# Altium project DCBus_PCB.PrjPcb
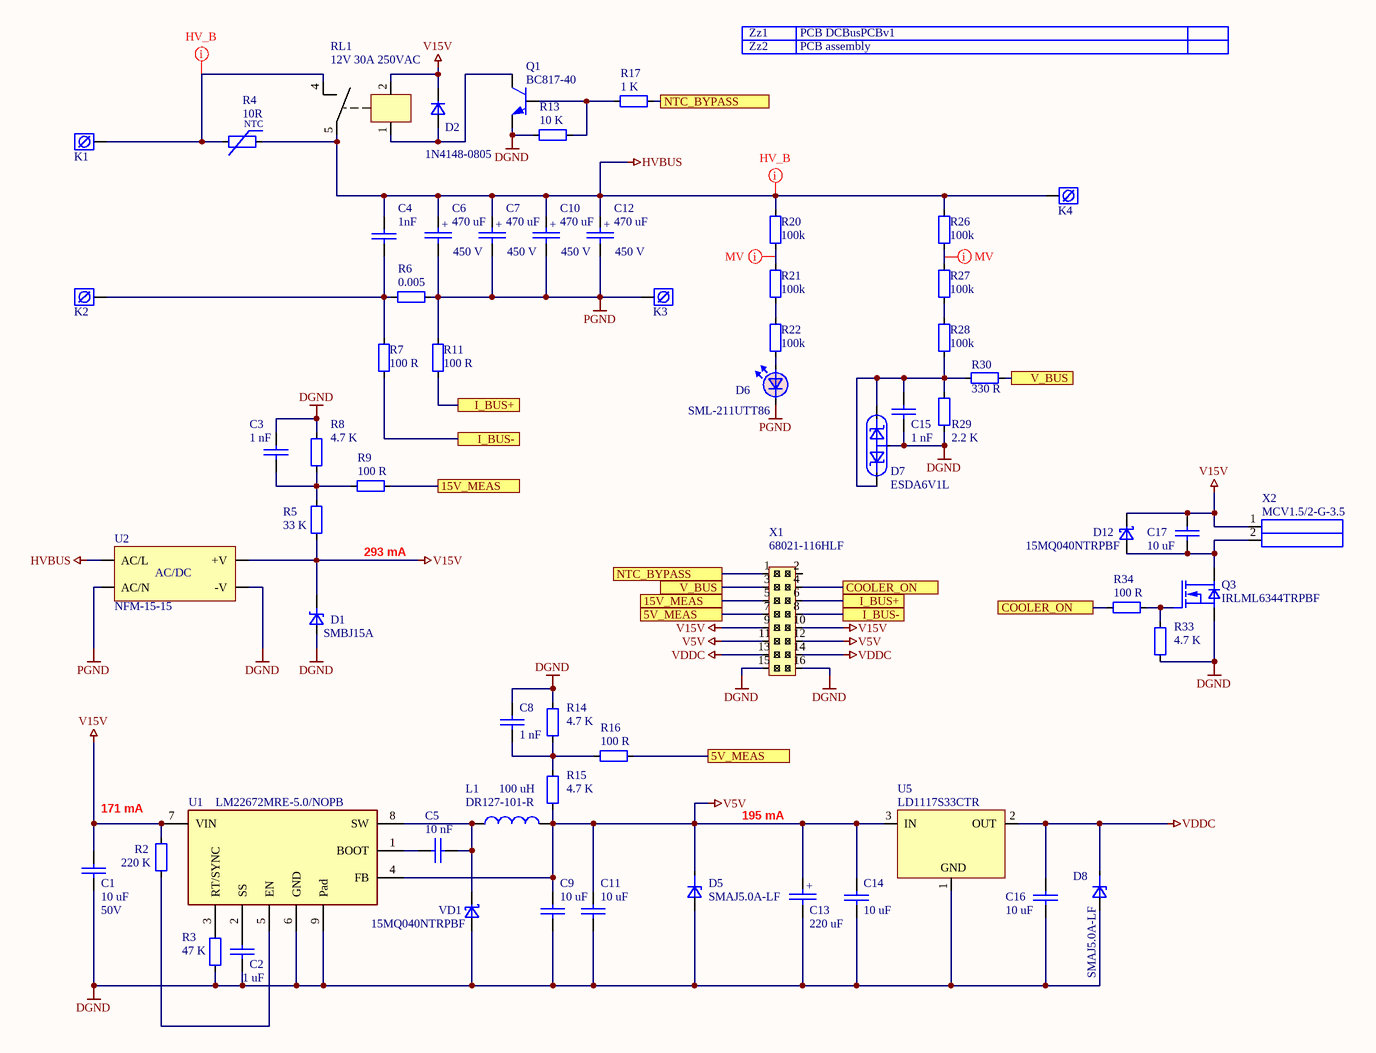
[diagram p0: Page1.SchDoc]
ProductNumber: Inverter; ProjectAuthor: BARDUVA UAB; ProjectVersion: 2013.06.11; Sheets: 2
1 sheet, 64 parts. Net scope: flat (ports and power ports of the same name join across sheets).
Board file: DCBus_PCB_v1.0.PcbDoc

## Sheet Page1.SchDoc
size A3; SheetNumber: 1; PageSetup: Record=PageOptions|CenterHorizontal=True|CenterVertical=True|PrintScale=1.00|XCorrection=1.00|YCorrection=1.00|PrintKind=1|BorderSize=5000000|LeftOffset=0|BottomOffset=0|Orientation=2|PaperLength=4200|PaperWidth=2970|Scale=100|PaperSource=256|PrintQuality=600|MediaType=0|DitherType=0|PaperKind=A3|PrintScaleMode=1

### Parts
C1  value 10 uF  Voltage: 50V  [3225[1210]]  (hidden comment: GRM32DF51H106ZA01L)
C2  value 1 uF  [2012[0805]]  (hidden comment: GRM21BR71A105KA01L)
C3  value 1 nF  [1608[0603]]  (hidden comment: CL10B102KB8NNNC)
C4  value 1nF  [B32529C8102J]  (hidden comment: B32529C8102J)
C5  value 10 nF  [1608[0603]]  (hidden comment: CL10B103JB8NNNC)
C6  value 470 uF  Voltage: 450 V  [ESMH451VNN471MA50T]  (hidden comment: ESMH451VNN471MA50T)
C7  value 470 uF  Voltage: 450 V  [ESMH451VNN471MA50T]  (hidden comment: ESMH451VNN471MA50T)
C8  value 1 nF  [1608[0603]]  (hidden comment: CL10B102KB8NNNC)
C9  value 10 uF  [0805-1206]  (hidden comment: LMK212F106ZG-T)
C10  value 470 uF  Voltage: 450 V  [ESMH451VNN471MA50T]  (hidden comment: ESMH451VNN471MA50T)
C11  value 10 uF  [0805-1206]  (hidden comment: LMK212F106ZG-T)
C12  value 470 uF  Voltage: 450 V  [ESMH451VNN471MA50T]  (hidden comment: ESMH451VNN471MA50T)
C13  value 220 uF  [Tant case C (6032-28)]  (hidden comment: TPSD227M010R0150)
C14  value 10 uF  [0805-1206]  (hidden comment: LMK212F106ZG-T)
C15  value 1 nF  [1608[0603]]  (hidden comment: CL10B102KB8NNNC)
C16  value 10 uF  [0805-1206]  (hidden comment: LMK212F106ZG-T)
C17  value 10 uF  [0805-1206]  (hidden comment: LMK212F106ZG-T)
D1  SMBJ15A  [SMB ST]
D2  1N4148-0805  [DIODE1206_LL4148]
D5  SMAJ5.0A-LF  [DO-214AA_SMBJ]
D6  SML-211UTT86  [0805 LED]
D7  ESDA6V1L  [SOT23]
D8  SMAJ5.0A-LF  [DO-214AA_SMBJ]
D12  15MQ040NTRPBF  [SMA]
K1  Screw terminal KEYS7692 front  [KEY7692_front]  (value not drawn)  (net tie, no BOM)
K2  Screw terminal KEYS7692 front  [KEY7692_front]  (value not drawn)  (net tie, no BOM)
K3  Screw terminal KEYS7692 front  [KEY7692_front]  (value not drawn)  (net tie, no BOM)
K4  Screw terminal KEYS7692 front  [KEY7692_front]  (value not drawn)  (net tie, no BOM)
L1  DR127-101-R  value 100 uH  [DR127]
Q1  BC817-40  [SOT23]
Q3  IRLML6344TRPBF  [SOT23]
R2  value 220 K  [0603]  (hidden comment: RC0603FR-07220KL)
R3  value 47 K  [0603]  (hidden comment: RC0603FR-0747KL)
R4  value 10R  [B57464]  (hidden comment: B57464S100M000)
R5  value 33 K  [0603]  (hidden comment: RC0603FR-0733KL)
R6  value 0.005  [MCS3264]  (hidden comment: MCS3264R005FER)
R7  value 100 R  [0603]  (hidden comment: ERJ-3EKF1000V)
R8  value 4.7 K  [0603]  (hidden comment: RJ0603FRE074K7L)
R9  value 100 R  [0603]  (hidden comment: ERJ-3EKF1000V)
R11  value 100 R  [0603]  (hidden comment: ERJ-3EKF1000V)
R13  value 10 K  [0603]  (hidden comment: ERJ-3EKF1002V)
R14  value 4.7 K  [0603]  (hidden comment: RJ0603FRE074K7L)
R15  value 4.7 K  [0603]  (hidden comment: RJ0603FRE074K7L)
R16  value 100 R  [0603]  (hidden comment: ERJ-3EKF1000V)
R17  value 1 K  [0603]  (hidden comment: RC0603FR-071KL)
R20  value 100k  [3216[1206]]  (hidden comment: ERJ-8ENF1003V)
R21  value 100k  [3216[1206]]  (hidden comment: ERJ-8ENF1003V)
R22  value 100k  [3216[1206]]  (hidden comment: ERJ-8ENF1003V)
R26  value 100k  [3216[1206]]  (hidden comment: ERJ-8ENF1003V)
R27  value 100k  [3216[1206]]  (hidden comment: ERJ-8ENF1003V)
R28  value 100k  [3216[1206]]  (hidden comment: ERJ-8ENF1003V)
R29  value 2.2 K  [0603]  (hidden comment: RC0603FR-072K2L)
R30  value 330 R  [0603]  (hidden comment: RC0603FR-07330RL)
R33  value 4.7 K  [0603]  (hidden comment: RJ0603FRE074K7L)
R34  value 100 R  [0603]  (hidden comment: ERJ-3EKF1000V)
RL1  value 12V 30A 250VAC  [T90]  (hidden comment: T9AS1D12-12)
U1  PartName: LM22672MRE-5.0/NOPB  [SOIC-8 EDP]  (hidden comment: LM22672)
U2  NFM-15-15  [NFM-15]
U5  LD1117S33CTR  [SOT-223]
VD1  15MQ040NTRPBF  [SMA]
X1  68021-116HLF  [68021-116HLF]
X2  MCV1.5/2-G-3.5  [mcv1.5-2-g_3.5]
Zz1  PCB DCBusPCBv1
Zz2  PCB assembly

### Ports
5V_MEAS, 15V_MEAS, COOLER_ON, I_BUS+, I_BUS-, NTC_BYPASS, V_BUS

### Nets
DGND: C1.2 C2.1 C3.1 C8.1 C9.1 C11.1 C13.2 C14.1 C15.2 C16.1 D1.1 D5.2(A) D7.3 D8.2(A) Q1.2(E) Q3.2(S) R3.1 R8.2 R13.1 R14.2 R29.2 R33.1 U1.6(GND) U1.9(Pad) U2.-V U5.1(GND) VD1.A X1.15 X1.16
HVBUS: C4.1 C6.1 C7.1 C10.1 C12.1 K4.1 R4.2 R20.1 R26.1 RL1.5 U2.AC/L
PGND: C6.2 C7.2 C10.2 C12.2 D6.2 K3.1 R6.2 R11.2 U2.AC/N
V5V: C9.2 C11.2 C13.1 C14.2 D5.1(C) L1.2 R15.1 U1.4(FB) U5.3(IN) X1.11 X1.12
V15V: C1.1 C17.2 D1.2 D2.1(C) D12.K R2.2 R5.1 RL1.2 U1.7(VIN) U2.+V X1.9 X1.10 X2.1
VDDC: C16.2 D8.1(C) U5.2(OUT) X1.13 X1.14
5V_MEAS: R16.2 X1.7 ; port 5V_MEAS
15V_MEAS: R9.2 X1.5 ; port 15V_MEAS
COOLER_ON: R34.2 X1.4 ; port COOLER_ON
I_BUS+: R11.1 X1.6 ; port I_BUS+
I_BUS-: R7.1 X1.8 ; port I_BUS-
NTC_BYPASS: R17.1 X1.1 ; port NTC_BYPASS
V_BUS: R30.1 X1.3 ; port V_BUS
NetC2_2: C2.2 U1.2(SS)
NetC3_2: C3.2 R5.2 R8.1 R9.1
NetC4_2: C4.2 K2.1 R6.1 R7.2
NetC5_1: C5.1 L1.1 U1.8(SW) VD1.K
NetC5_2: C5.2 U1.1(BOOT)
NetC8_2: C8.2 R14.1 R15.2 R16.1
NetC15_1: C15.1 D7.1 D7.2 R28.2 R29.1 R30.2
NetC17_1: C17.1 D12.A Q3.3(D) X2.2
NetD2_2: D2.2(A) Q1.3(C) RL1.1
NetD6_1: D6.1 R22.2
NetK1_1: K1.1 R4.1 RL1.4
NetQ1_1: Q1.1(B) R13.2 R17.2
NetQ3_1: Q3.1(G) R33.2 R34.1
NetR2_1: R2.1 U1.5(EN)
NetR3_2: R3.2 U1.3(RT/SYNC)
NetR20_2: R20.2 R21.1
NetR21_2: R21.2 R22.1
NetR26_2: R26.2 R27.1
NetR27_2: R27.2 R28.1

Not connected (* = marked no-connect by the designer): X1 2

### Layout directives
net class HV_B: HVBUS, NetK1_1
net class MV: NetR20_2, NetR26_2

### Notes on the sheet
- 293 mA
- 171 mA
- 195 mA
- (in symbol B57464S100M000) NTC
- (in symbol ESMH451VNN471MA50T) +
- (in symbol NFM-15-15) AC/DC
- (in symbol T520C157M010ATE055) +

### Library data of the parts
C1 = GRM32DF51H106ZA01L: 10uF, 50V, 20%, Y5V (F), 1210; Manufacturer: Murata Electronics North America; PartNum: 490-1891-1-ND; Tolerance: 20%; Price: 0.39$; Distributor: Digi-Key; PartName: GRM32DF51H106ZA01L
C2 = GRM21BR71A105KA01L: 1 uF, 10V, 10%, X7R, 0805; Manufacturer: Murata; Tolerance: 10%; Price: 0.11$; Distributor: Mouser; PartNum: GRM21BR71A105KA01L; PartName: GRM21BR71A105KA01L
C3 C8 C15 = CVNF1.0K0603_1: 1 nF, 50V, 10%, X7R, 0603 SMD MLC Capacitor; Manufacturer: SAMSUNG; Tolerance: 10%; Distributor: Future; Price: 0.002$; PartNum: CL10B102KB8NNNC; Voltage: 50 V; PartName: CL10B102KB8NNNC; Price50: 0.002$; Price100: 0.002$; Price1000: 0.002$
C4 = B32529C8102J: CAP FILM 1000PF 630VDC 400VAC RADIAL Lead Spacing 5mm; Manufacturer: Epcos; PartNum: 495-1255-ND; Tolerance: 20%; Voltage: 400VAC 630VDC; Distributor: Digi-Key; Price: 0.45$; PartName: B32529C8102J; Link: http://www.digikey.com/product-detail/en/B32529C8102J/495-1255-ND/592832
C5 = CVNF010K0603: 10 nF, 50V, 5%, X7R, 0603 SMD MLC Capacitor; Manufacturer: SAMSUNG; Tolerance: 5%; Distributor: Future; Price: 0.0045 Euro; PartNum: CL10B103JB8NNNC; Voltage: 50 V; PartName: CL10B103JB8NNNC; Price50: 0.0045 Euro; Price100: 0.0045 Euro; Price1000: 0.0045 Euro
C6 C7 C10 C12 = ESMH451VNN471MA50T: 470uF 450V, 20%, -40..+85, 2000 Hrs @ 85°C, 35*50; Manufacturer: UNITED CHEMICON; Tolerance: +-20%; Distributor: Future; Price: 3 Euro; PartNum: ESMH451VNN471MA50T; PartName: ESMH451VNN471MA50T
C9 C11 C14 C16 C17 = LMK212F106ZG-T: CAP CER 10UF 10V 10% X5R 0805; Manufacturer: Taiyo Yuden; PartNum: 587-1300-1-ND; PartName: LMK212BJ106KG-T; Distributor: Digi-Key; Price: 0.038$; Tolerance: 10%; Voltage: 10V
C13 = T520C157M010ATE055: 220.0 uF, 10V 20%, -55...105 C, SMD Tantalum; Manufacturer: AVX Connectors; Ordered: Future; Distributor: Future; Tolerance: 20%; Price: 0.49 Euro; PartNum: TPSD227M010R0150; Voltage: 10V; PartName: TPSD227M010R0150; Price50: 0.44 Euro; Price100: 0.44 Euro; Price1000: 0.44 Euro
D1 = SMBJ15A: DIODE TVS 15V 600W UNI 5% SMD; Manufacturer: TAIWAN SEMICONDUCTOR; PartNum: 7277733RL; Distributor: Farnell; Price: 1.77; PartName: SMBJ15A; Value: 15 V
D2 = Diode 100V 0805 1N4148: Switching diode; 500mA; 4ns; 0805, 100V, 300mA; Manufacturer: DC COMPONENTS; Distributor: TME; PartNum: 1N4148-0805; Price: 0.054; Link: http://www.tme.eu/lt/details/1n4148-0805/smd-universalus-diodai/dc-components/cd4148ws0805c/#; PartName: 1N4148-0805
D5 D8 = SMAJ5.0A-LF: TVS 400W 5.0V Unidirect; Manufacturer: LITTELFUSE; Distributor: TME; Price: 0.212; PartNum: SMAJ5.0A-LF; PartName: SMAJ5.0A-LF
D6 = SML-211UTT86: 0805 red LED, hibright, 2 mA, 1.8V, 130°; Manufacturer: Rohm; PartNum: 511-1292-1-ND; Distributor: Digi-Key; Price: 0.34$; Value: Red; PartName: SML-211UTT86
D7 = ESDA6V1L: Dual transil array for ESD, 6.1 V, 300 W; Manufacturer: Micro Commercial Co; PartNum: ESDA6V1L-TPCT-ND; PartName: ESDA6V1L-TP; Distributor: Digi-Key; Price: 0.23$
D12 VD1 = 15MQ040N: Schottky Power Rectifier 3A, 40V, SMA; Manufacturer: VISHAY; Ordered: Future; Price: 0.13 Euro; Distributor: Digi-Key; PartNum: 15MQ040NTRPBF; PartName: 15MQ040NTRPBF; Price50: 0.11 Euro; Price100: 0.11 Euro; Price1000: 0.1 Euro
L1 = DR127-101-R: 100 uH, 1.96A, ±20%, 163 mOhm; Manufacturer: Coiltronics/Div of Cooper/Bussmann; PartNum: 513-1038-1-ND; Distributor: Digi-Key; Price: 1.7$; Tolerance: ±20%; PartName: DR127-101-R
Q1 = BC817-40: NPN 45V 0,5A 0,25W B:250-600 SOT23; Manufacturer: NXP Semiconductors; PartNum: 568-1631-1-ND; Price: 0.05$; Distributor: Digi-Key; PartName: 568-1631-1-ND
Q3 = IRLML6344TRPBF: N-channel MOSFET, 30V, 5A, 0.030 Ohm 3.3 V, SOT-23; Manufacturer: International Rectifier; PartNum: IRLML6344TRPBFCT-ND; Price: 0.23$; Distributor: DigiKey; PartName: IRLML6344TRPBF
R2 = RL0603K220-1_1: 220 K, 1%, 0603, SMD Resistor, Taped; Manufacturer: YAGEO AMERICA CORPORATION; Voltage: 75 V; Distributor: Future; Price: 0.0017$; Tolerance: 1%; PartNum: RC0603FR-07220KL; PartName: RC0603FR-07220KL; Price50: 0.0017$; Price100: 0.0017$; Price1000: 0.0017$
R3 = RC0603FR-0747KL: 47 K, 1%, 0603, SMD Resistor, Taped; Manufacturer: YAGEO AMERICA CORPORATION; Voltage: 75 V; Distributor: Future; Price: 0.002 Euro; Tolerance: 1%; PartNum: RC0603FR-0747KL; PartName: RC0603FR-0747KL
R4 = B57464S100M000: CURRENT LIMITER INRSH 10 OHM 20%, 8A, Lead Spacing 7.5mm; Manufacturer: EPCOS Inc; PartNum: 495-4111-ND; Distributor: Digi-Key; Price: 4.78$; Link: http://www.digikey.com/scripts/dksearch/dksus.dll?vendor=0&keywords=B57464S0100M; PartName: B57464S100M000
R5 = RL0603K033-1_1: 33 K, 1%, 0603, SMD Resistor, Taped; Manufacturer: YAGEO AMERICA CORPORATION; Voltage: 75 V; Distributor: Future; Price: 0.0017$; Tolerance: 1%; PartNum: RC0603FR-0733KL; PartName: RC0603FR-0733KL; Price50: 0.0017$; Price100: 0.0017$; Price1000: 0.0017$
R6 = MCS3264R005FER: Curr.sens.res. 0.005 OHM 2W 1% , 2512 (6432 Metric); Manufacturer: Ohmite; PartNum: MCS3264R005FERCT-ND; Distributor: Digi-Key; Price: 0.3$; Tolerance: 1%; PartName: MCS3264R005FER; Price50: 0.3$
R7 R9 R11 R16 R34 = RL0603E100-1_1: 100 R, 1%, 0603, SMD Resistor, Taped; Manufacturer: PANASONIC; Voltage: 75 V; Distributor: Future; Price: 0.0017$; Tolerance: 1%; PartNum: ERJ-3EKF1000V; PartName: ERJ-3EKF1000V; Price50: 0.0015 Euro; Price100: 0.0015 Euro; Price1000: 0.0015 Euro
R8 R14 R15 R33 = RL0603K004.7-1_1: 4.7 K, 1%, 0603, SMD Resistor, Taped; Manufacturer: YAGEO AMERICA CORPORATION; Voltage: 75 V; Distributor: Future; Price: 0.0017$; Tolerance: 1%; PartNum: RJ0603FRE074K7L; PartName: RJ0603FRE074K7L; Price50: 0.0017$; Price100: 0.0017$; Price1000: 0.0017$
R13 = RL0603K010-1: 10 K, 1%, 0603, SMD Resistor, Taped; Manufacturer: PANASONIC; Voltage: 75 V; Distributor: Future; Price: 0.0015 Euro; Tolerance: 1%; PartNum: ERJ-3EKF1002V; PartName: ERJ-3EKF1002V; Price50: 0.0015 Euro; Price100: 0.0015 Euro; Price1000: 0.0015 Euro
R17 = RL0603K001-1_1: 1 K, 1%, 0603, SMD Resistor, Taped; Manufacturer: YAGEO AMERICA CORPORATION; Voltage: 75 V; Distributor: Future; Price: 0.0017$; Tolerance: 1%; PartNum: RC0603FR-071KL; PartName: RC0603FR-071KL; Price50: 0.0017$; Price100: 0.0017$; Price1000: 0.0017$
R20-R22 R26-R28 = RL1206K100-1: 100K, 1%,  1206,  200v,  SMD 1206; Manufacturer: Panasonic; Distributor: Future; PartNum: ERJ-8ENF1003V; Price: 0.0036Euro; Voltage: 200v; Tolerance: 1%; PartName: ERJ-8ENF1003V
R29 = RL0603K002.2-1_1: 2.2 K, 1%, 0603, SMD Resistor, Taped; Manufacturer: YAGEO AMERICA CORPORATION; Voltage: 75 V; Distributor: Future; Price: 0.0017$; Tolerance: 1%; PartNum: RC0603FR-072K2L; PartName: RC0603FR-072K2L; Price50: 0.0017$; Price100: 0.0017$; Price1000: 0.0017$
R30 = RL0603E330-1_1: 330 R, 1%, 0603, SMD Resistor, Taped; Manufacturer: YAGEO AMERICA CORPORATION; Voltage: 75 V; Distributor: Future; Price: 0.0017$; Tolerance: 1%; PartNum: RC0603FR-07330RL; PartName: RC0603FR-07330RL; Price50: 0.0017$; Price100: 0.0017$; Price1000: 0.0017$
RL1 = Relay T9AS1D12-12: Relay, SPST-NO; PCB; 144R; 9-12VDC; 30A/250VAC; PartNum: 2-1393209-8; Manufacturer: TE CONNECTIVITY; Distributor: TME; Price: 4.604; PartName: T9AS1D12-12; Link: http://www.tme.eu/lt/details/t90s5d12-12/aukshtos-sroves-elektromag-reles/te-connectivity/2-1393209-8/#
U1 = LM22672MRE-5.0: SIMPLESWITCH, 1.0A 4.5~42VIN, 8PSOP; Manufacturer: National Semiconductor; PartNum: LM22672MRE-5.0CT-ND; Price: 4.09$; Distributor: Digi-Key
U2 = NFM-15-15: AC/DC 15W, 15V, -20..+70 C; Manufacturer: Mean Well; Price: 10.3 Euro; Distributor: TME; PartNum: NFM-15-15
U5 = LD1117S33CTR: Low drop positive voltage regulator, 3.3 V, 1A, SOT-223; Manufacturer: STMicroelectronics; PartNum: 497-1241-1-ND; Distributor: Digi-Key; Price: 0.59$; PartName: LD1117S33CTR
X1 = 68021-116HLF: Headers & Wire Housings 16P SR UNSHRD HRD .76 GOLD OVER NI; Manufacturer: FCI; PartNum: 649-68021-116HLF; Distributor: Mouser; Price: 0.38 Euro; PartName: 68021-116HLF
X2 = MCV1.5/2-G-3.5: HEADER, VERTICAL, 3.5MM, 2WAY; Manufacturer: PHOENIX CONTACT; PartNum: 3704816; PartName: 1843606; Distributor: Farnell; Price: 0.31 Euro
Zz1 = BOM item: Manufacturer: Brandner; PartNum: DCBusPCBv1 board; PartName: DCBusPCBv1; Price: 10 Euro
Zz2 = BOM item: Manufacturer: ESEMDA; PartNum: DCBusPCBv2 assembly; PartName: PCB assembly; Price: 30